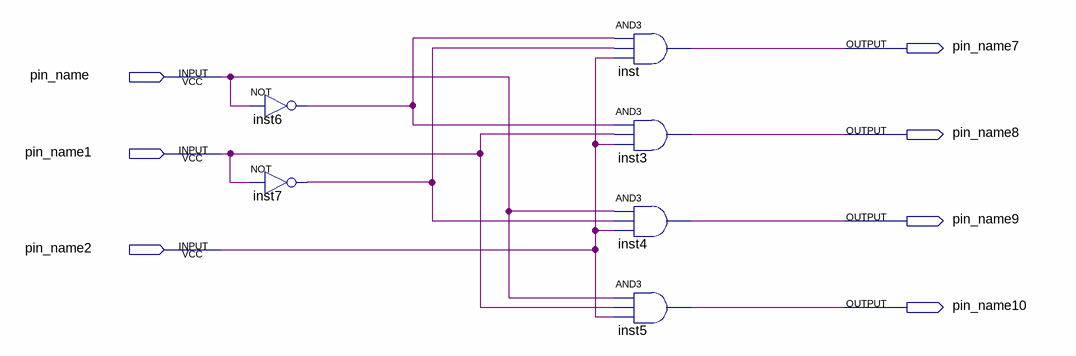
[diagram p0: schematic sheet]
// Quartus schematic demultiplexador.bdf as structural Verilog: 6 symbols, 7 pins
module demultiplexador (
  input  pin_name,
  input  pin_name1,
  input  pin_name2,
  output pin_name7,
  output pin_name8,
  output pin_name9,
  output pin_name10
);

  wire inst6_out, inst7_out;

  not inst6 (inst6_out, pin_name);
  not inst7 (inst7_out, pin_name1);
  and inst (pin_name7, inst6_out, inst7_out, pin_name2);
  and inst3 (pin_name8, inst6_out, pin_name1, pin_name2);
  and inst4 (pin_name9, pin_name, inst7_out, pin_name2);
  and inst5 (pin_name10, pin_name, pin_name1, pin_name2);
endmodule
